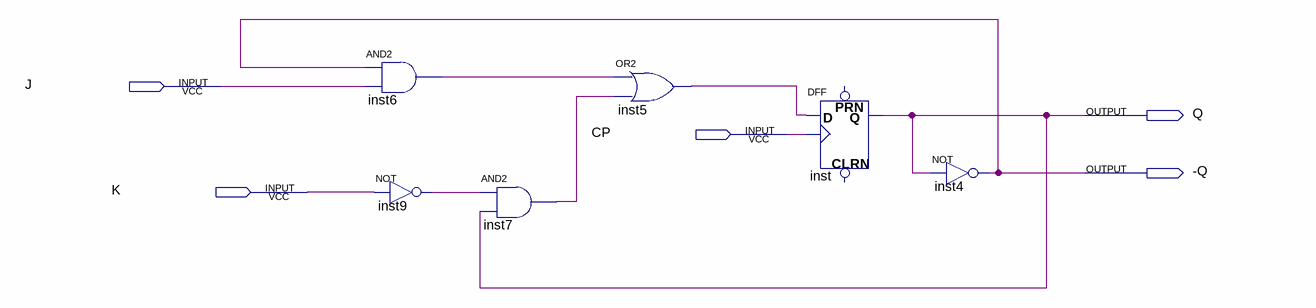
[diagram p0: schematic sheet]
// Quartus schematic D_JK.bdf as structural Verilog: 6 symbols, 5 pins
module D_JK (
  input  J,
  input  CP,
  input  K,
  output Q,
  output \-Q 
);

  wire inst5_out, inst6_out, inst7_out, inst9_out;

  and inst6 (inst6_out, \-Q , J);
  not inst9 (inst9_out, K);
  and inst7 (inst7_out, inst9_out, Q);
  or inst5 (inst5_out, inst6_out, inst7_out);
  DFF inst (.CLK(CP), .D(inst5_out), .Q(Q));  // open: CLRN, PRN
  not inst4 (\-Q , Q);
endmodule
